# EasyEDA Pro project ProPrj_super_cap_ctrl_v1.0_2025-02-24.epro, schematic 功率原理图
Board Name: 功率上板v1.0; Create Date: 2024-10-04; Page Name: Buck_Boost; Project Name: h桥电路test_v1.0; Schematic Name: 功率原理图; Update Date: 2024-10-22; Company: 嘉立创EDA; Page Size: A3; Version: V1.0
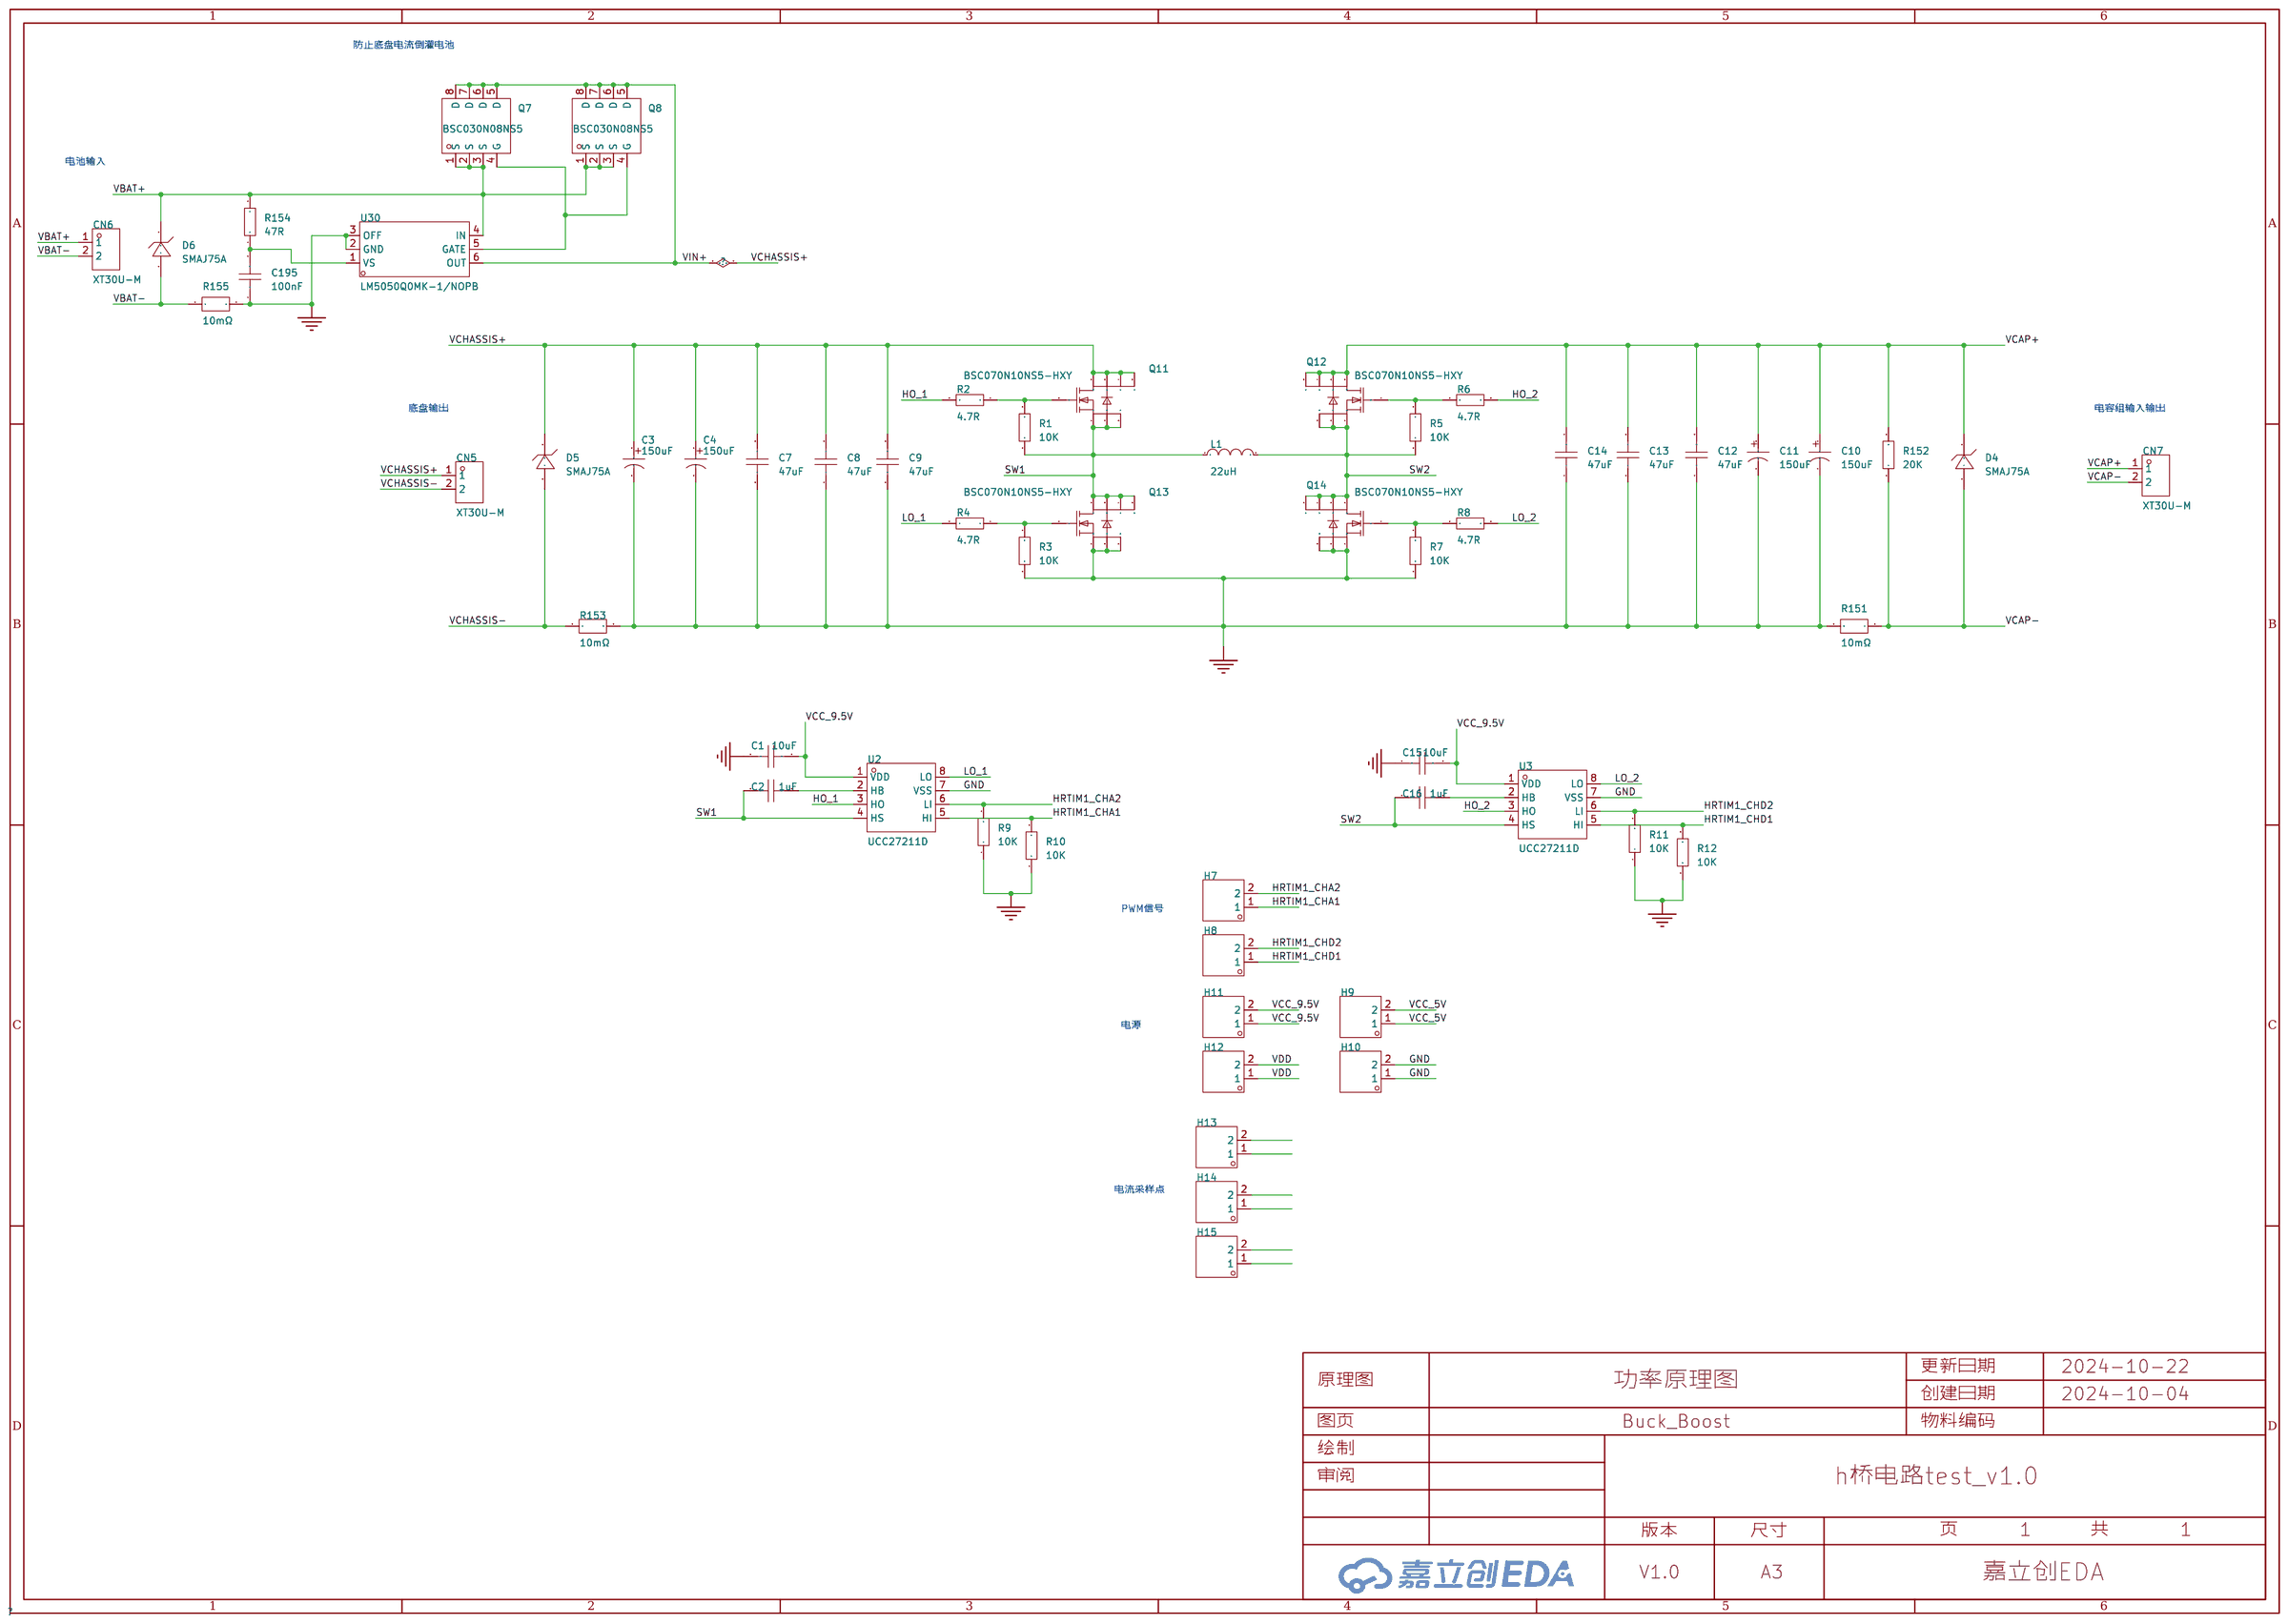
[diagram p4: schematic sheet]

## Parts
C1  10uF  [C0603]
C2  1uF  [C0805]
C3  150uF  [CAP-SMD_BD10.0-L10.3-W10.3-LS11.3-FD]
C4  150uF  [CAP-SMD_BD10.0-L10.3-W10.3-LS11.3-FD]
C7  47uF  [C1210]
C8  47uF  [C1210]
C9  47uF  [C1210]
C10  150uF  [CAP-SMD_BD10.0-L10.3-W10.3-LS11.3-FD]
C11  150uF  [CAP-SMD_BD10.0-L10.3-W10.3-LS11.3-FD]
C12  47uF  [C1210]
C13  47uF  [C1210]
C14  47uF  [C1210]
C15  10uF  [C0603]
C16  1uF  [C0805]
C195  100nF  [C0603]
CN5  XT30U-M  [CONN-TH_XT30U-M]
CN6  XT30U-M  [CONN-TH_XT30U-M]
CN7  XT30U-M  [CONN-TH_XT30U-M]
D4  SMAJ75A  [SMA_L4.3-W2.6-LS5.0-RD]
D5  SMAJ75A  [SMA_L4.3-W2.6-LS5.0-RD]
D6  SMAJ75A  [SMA_L4.3-W2.6-LS5.0-RD]
H7  -  [HDR-TH_2P-P2.54-V-M-1]
H8  -  [HDR-TH_2P-P2.54-V-M-1]
H9  -  [HDR-TH_2P-P2.54-V-M-1]
H10  -  [HDR-TH_2P-P2.54-V-M-1]
H11  -  [HDR-TH_2P-P2.54-V-M-1]
H12  -  [HDR-TH_2P-P2.54-V-M-1]
H13  -  [HDR-TH_2P-P2.54-V-M-1]
H14  -  [HDR-TH_2P-P2.54-V-M-1]
H15  -  [HDR-TH_2P-P2.54-V-M-1]
L1  22uH  [IND-SMD_L17.5-W17.0_YXMAC1770]
Q7  BSC030N08NS5  [PG-TDSON-8_L5.0-W6.0-P1.27-BL-EP]
Q8  BSC030N08NS5  [PG-TDSON-8_L5.0-W6.0-P1.27-BL-EP]
Q11  BSC070N10NS5-HXY  [PDFN-8_L6.0-W5.0-P1.27-BL-A]
Q12  BSC070N10NS5-HXY  [PDFN-8_L6.0-W5.0-P1.27-BL-A]
Q13  BSC070N10NS5-HXY  [PDFN-8_L6.0-W5.0-P1.27-BL-A]
Q14  BSC070N10NS5-HXY  [PDFN-8_L6.0-W5.0-P1.27-BL-A]
R1  10K  [R0603]
R2  4.7R  [R0603]
R3  10K  [R0603]
R4  4.7R  [R0603]
R5  10K  [R0603]
R6  4.7R  [R0603]
R7  10K  [R0603]
R8  4.7R  [R0603]
R9  10K  [R0603]
R10  10K  [R0603]
R11  10K  [R0603]
R12  10K  [R0603]
R151  10mΩ  [RES-SMD_L6.4-W3.2-R2512]
R152  20K  [R1206]
R153  10mΩ  [RES-SMD_L6.4-W3.2-R2512]
R154  47R  [R0603]
R155  10mΩ  [RES-SMD_L6.4-W3.2-R2512]
U2  UCC27211D  [SOIC-8_L4.9-W3.9-P1.27-LS6.0-BL]
U3  UCC27211D  [SOIC-8_L4.9-W3.9-P1.27-LS6.0-BL]
U30  LM5050Q0MK-1/NOPB  [SOT-23-6_L2.9-W1.6-P0.95-LS2.8-BL]

## Library data of the parts
C1 C2 C15 C16 C195 = CAP_0603: Supplier Footprint: 0603
C3 C4 C10 C11 = RVT1H151M1010: 容值:150uF;精度:±20%;额定电压:50V;纹波电流:178mA@120Hz;等效串联电阻:-;; LCSC Part Name: 150uF ±20% 50V; Supplier Part: C72490; Manufacturer: ROQANG(容强); Supplier Footprint: SMD,D10xL10.2mm; JLCPCB Part Class: 扩展库; Datasheet: https://atta.szlcsc.com/upload/public/pdf/source/20170325/1490427950282.pdf; Supplier: LCSC; Tolerance: ±20%; Rated Voltage: 50V; Ripple Current: 178mA@120Hz; φD: 10mm; L: 10.2mm; Lifetime @ Temp: 2000hrs@105℃; Operating Temperature: -40℃~+105℃
C7-C9 C12-C14 = GRM32ER61C476KE15L: 容值:47uF;精度:±10%;额定电压:16V;材质(温度系数):X5R;; LCSC Part Name: 47uF ±10% 16V; Supplier Part: C77101; Manufacturer: muRata(村田); Supplier Footprint: 1210; JLCPCB Part Class: 扩展库; Datasheet: https://atta.szlcsc.com/upload/public/pdf/source/20221202/FF58125DCA7AB78AED268D88B743009A.pdf; Supplier: LCSC; Tolerance: ±10%; Voltage Rated: 16V; Temperature Coefficient: X5R
CN5-CN7 = XT30U-M: 类别:-;类型1:-;; LCSC Part Name: AMASS(艾迈斯)轻量版锂电池插头公头 XT30U-M; Supplier Part: C99101; Manufacturer: AMASS(艾迈斯); JLCPCB Part Class: 扩展库; Datasheet: https://atta.szlcsc.com/upload/public/pdf/source/20170606/1496716542582.pdf; Supplier: LCSC; Brand: 艾迈斯; Type: 插头; Colour: 黄色; InterfaceType: 公头
D4-D6 = SMAJ75A: 反向截止电压(Vrwm):75V;最大钳位电压:121V;峰值脉冲电流(Ipp)@10/1000us:3.3A;峰值脉冲功率(Ppp)@10/1000us:400W;击穿电压:83.3V;; LCSC Part Name: 单向TVS 75V截止 3.3A峰值脉冲; Supplier Part: C353422; Manufacturer: 晶导微电子; Supplier Footprint: SMA; JLCPCB Part Class: 扩展库; Datasheet: https://atta.szlcsc.com/upload/public/pdf/source/20190103/C353498_9C52E1B7CA7D9691073072057BB1DA1A.pdf; Supplier: LCSC; Reverse Stand-Off Voltage (Vrwm): 75V; Maximum Clamping Voltage: 121V; Peak Pulse Current (Ipp)@10/1000us: 3.3A; Peak Pulse Power Dissipation (Ppp)@10/1000us: 400W; Breakdown Voltage: 83.3V; Reverse Leakage Current (Ir): 1uA; Type: TVS
H7-H15 = HDR-M_2.54_1x2P: Supplier Part: C124375; Supplier Footprint: 插件
L1 = TMPC1707HP-220MG-D: 电感值:22uH;精度:±20%;额定电流:12A;; LCSC Part Name: 22uH ±20%; Supplier Part: C357281; Manufacturer: TAI-TECH(台庆); Supplier Footprint: SMD; JLCPCB Part Class: 扩展库; Datasheet: https://atta.szlcsc.com/upload/public/pdf/source/20200917/C357281_EE462FBEA55EDE7C42BA3A1159C6841E.pdf; Supplier: LCSC; Tolerance: ±20%; Rated Current: 12A; DC Resistance (DCR): 25.1mΩ
Q7 Q8 = BSC030N08NS5: 类型:N沟道;漏源电压(Vdss):80V;连续漏极电流(Id):100A;功率(Pd):2.5W;导通电阻(RDS(on)@Vgs,Id):3mΩ@10V,50A;阈值电压(Vgs(th)@Id):3.8V@95uA;; LCSC Part Name: N沟道 耐压:80V 电流:100A; Supplier Part: C501507; Manufacturer: Infineon(英飞凌); Supplier Footprint: TDSON-8-EP(5x6); JLCPCB Part Class: 扩展库; Datasheet: https://atta.szlcsc.com/upload/public/pdf/source/20200324/C501507_9C7B62D74123036478B65B3B25F9DBA5.pdf; Supplier: LCSC; Type: N沟道; Drain Source Voltage (Vdss): 80V; Continuous Drain Current (Id): 100A; Power Dissipation (Pd): 2.5W; Drain Source On Resistance (RDS(on)@Vgs,Id): 3mΩ@10V,50A; Gate Threshold Voltage (Vgs(th)@Id): 3.8V@95uA
Q11-Q14 = BSC070N10NS5-HXY: 类型:1个N沟道;漏源电压(Vdss):100V;连续漏极电流(Id):75A;导通电阻(RDS(on)@Vgs,Id):-;; LCSC Part Name: 1个N沟道 耐压:100V 电流:75A; Supplier Part: C22366974; Manufacturer: HXY MOSFET(华轩阳电子); Supplier Footprint: DFN-8L(5x6); JLCPCB Part Class: 扩展库; Datasheet: https://atta.szlcsc.com/upload/public/pdf/source/20240326/7C6FFAF376603E3B45F42077E7607E4B.pdf; Supplier: LCSC; Type: 1个N沟道; Drain Source Voltage (Vdss): 100V; Continuous Drain Current (Id): 75A
R1-R12 R152 R154 = Res_0603: Supplier Footprint: 0603
R151 R153 R155 = HoJLR2512-3W-10mR-1%: 电阻类型:采样电阻;阻值:10mΩ;精度:±1%;功率:3W;安装方式:贴片;; LCSC Part Name: 10mΩ ±1% 3W; Supplier Part: C2903468; Manufacturer: Milliohm(毫欧); Supplier Footprint: 2512; JLCPCB Part Class: 扩展库; Datasheet: https://atta.szlcsc.com/upload/public/pdf/source/20211009/7525CABAB363C979E942C1DD41F1FEF0.pdf; Supplier: LCSC; Type: 采样电阻; Tolerance: ±1%; Power(Watts): 3W; Mounting Sytle: 贴片
U2 U3 = UCC27211D: 驱动配置:半桥;负载类型:MOSFET;驱动通道数:2;峰值灌电流:4A;峰值拉电流:4A;电源电压:8V~17V;上升时间:7.2ns;下降时间:5.5ns;; Supplier Part: C1549388; Manufacturer: TI(德州仪器); Supplier Footprint: SOIC-8; JLCPCB Part Class: 扩展库; Datasheet: https://www.ti.com/cn/lit/gpn/ucc27211; Supplier: LCSC; Driven Configuration: 半桥; Load Type: MOSFET; Number of Drivers: 2; Peak Output Current(sink): 4A; Peak Output Current(source): 4A; Supply Voltage: 8V~17V; Rise Time: 7.2ns; Fall Time: 5.5ns; Operating Temperature: -40℃~+140℃@(Tj)
U30 = LM5050Q0MK-1/NOPB: 输入电压:5V~75V;; Supplier Part: C181306; Manufacturer: TI(德州仪器); Supplier Footprint: SOT-23-6; JLCPCB Part Class: 扩展库; Datasheet: https://www.ti.com/cn/lit/gpn/lm5050-1-q1; Supplier: LCSC; Input Voltage: 5V~75V; Operating Temperature	-: -40℃~+150℃

## Nets
GND: C1.1 C3.2 C4.2 C7.1 C8.1 C9.1 C10.2 C11.2 C12.1 C13.1 C14.1 C15.1 C195.1 H10.1 H10.2 Q13.1(S) Q13.2(S) Q13.3(S) Q14.1(S) Q14.2(S) Q14.3(S) R3.1 R7.1 R9.1 R10.1 R11.1 R12.1 R151.2 R153.2 R155.1 U2.7(VSS) U3.7(VSS) U30.2(GND) U30.3(OFF)
VBAT+: CN6.1 D6.1(C) Q7.1(S) Q7.2(S) Q7.3(S) Q8.1(S) Q8.2(S) Q8.3(S) R154.2 U30.4(IN)
VBAT-: CN6.2 D6.2(A) R155.2
VCC_5V: H9.1 H9.2
VCC_9.5V: C1.2 C15.2 H11.1 H11.2 U2.1(VDD) U3.1(VDD)
VDD: H12.1 H12.2
HO_1: R2.2 U2.3(HO)
HO_2: R6.2 U3.3(HO)
HRTIM1_CHA1: H7.1 R10.2 U2.5(HI)
HRTIM1_CHA2: H7.2 R9.2 U2.6(LI)
HRTIM1_CHD1: H8.1 R12.2 U3.5(HI)
HRTIM1_CHD2: H8.2 R11.2 U3.6(LI)
LO_1: R4.2 U2.8(LO)
LO_2: R8.2 U3.8(LO)
SW1: C2.1 L1.1 Q11.1(S) Q11.2(S) Q11.3(S) Q13.5(D) Q13.6(D) Q13.7(D) Q13.8(D) R1.1 U2.4(HS)
SW2: C16.1 L1.2 Q12.1(S) Q12.2(S) Q12.3(S) Q14.5(D) Q14.6(D) Q14.7(D) Q14.8(D) R5.1 U3.4(HS)
VCAP+: C10.1 C11.1 C12.2 C13.2 C14.2 CN7.1 D4.1(C) Q12.5(D) Q12.6(D) Q12.7(D) Q12.8(D) R152.2
VCAP-: CN7.2 D4.2(A) R151.1 R152.1
VCHASSIS+: C3.1 C4.1 C7.2 C8.2 C9.2 CN5.1 D5.1(C) Q7.5(D) Q7.6(D) Q7.7(D) Q7.8(D) Q8.5(D) Q8.6(D) Q8.7(D) Q8.8(D) Q11.5(D) Q11.6(D) Q11.7(D) Q11.8(D) U30.6(OUT)
VCHASSIS-: CN5.2 D5.2(A) R153.1
$1N418: C2.2 U2.2(HB)
$1N971: Q11.4(G) R1.2 R2.1
$1N1037: Q13.4(G) R3.2 R4.1
$1N1093: Q12.4(G) R5.2 R6.1
$1N1202: Q14.4(G) R7.2 R8.1
$1N4475: C16.2 U3.2(HB)
$1N6839: Q7.4(G) Q8.4(G) U30.5(GATE)
$1N6847: C195.2 R154.1 U30.1(VS)

Not connected (* = marked no-connect by the designer): H13 1 2; H14 1 2; H15 1 2

## Notes on the sheet
- 防止底盘电流倒灌电池
- 电池输入
- 底盘输出
- 电容组输入输出
- PWM信号
- 电源
- 电流采样点
